# EAGLE design bigGenericPWM (EAGLE 4.16)
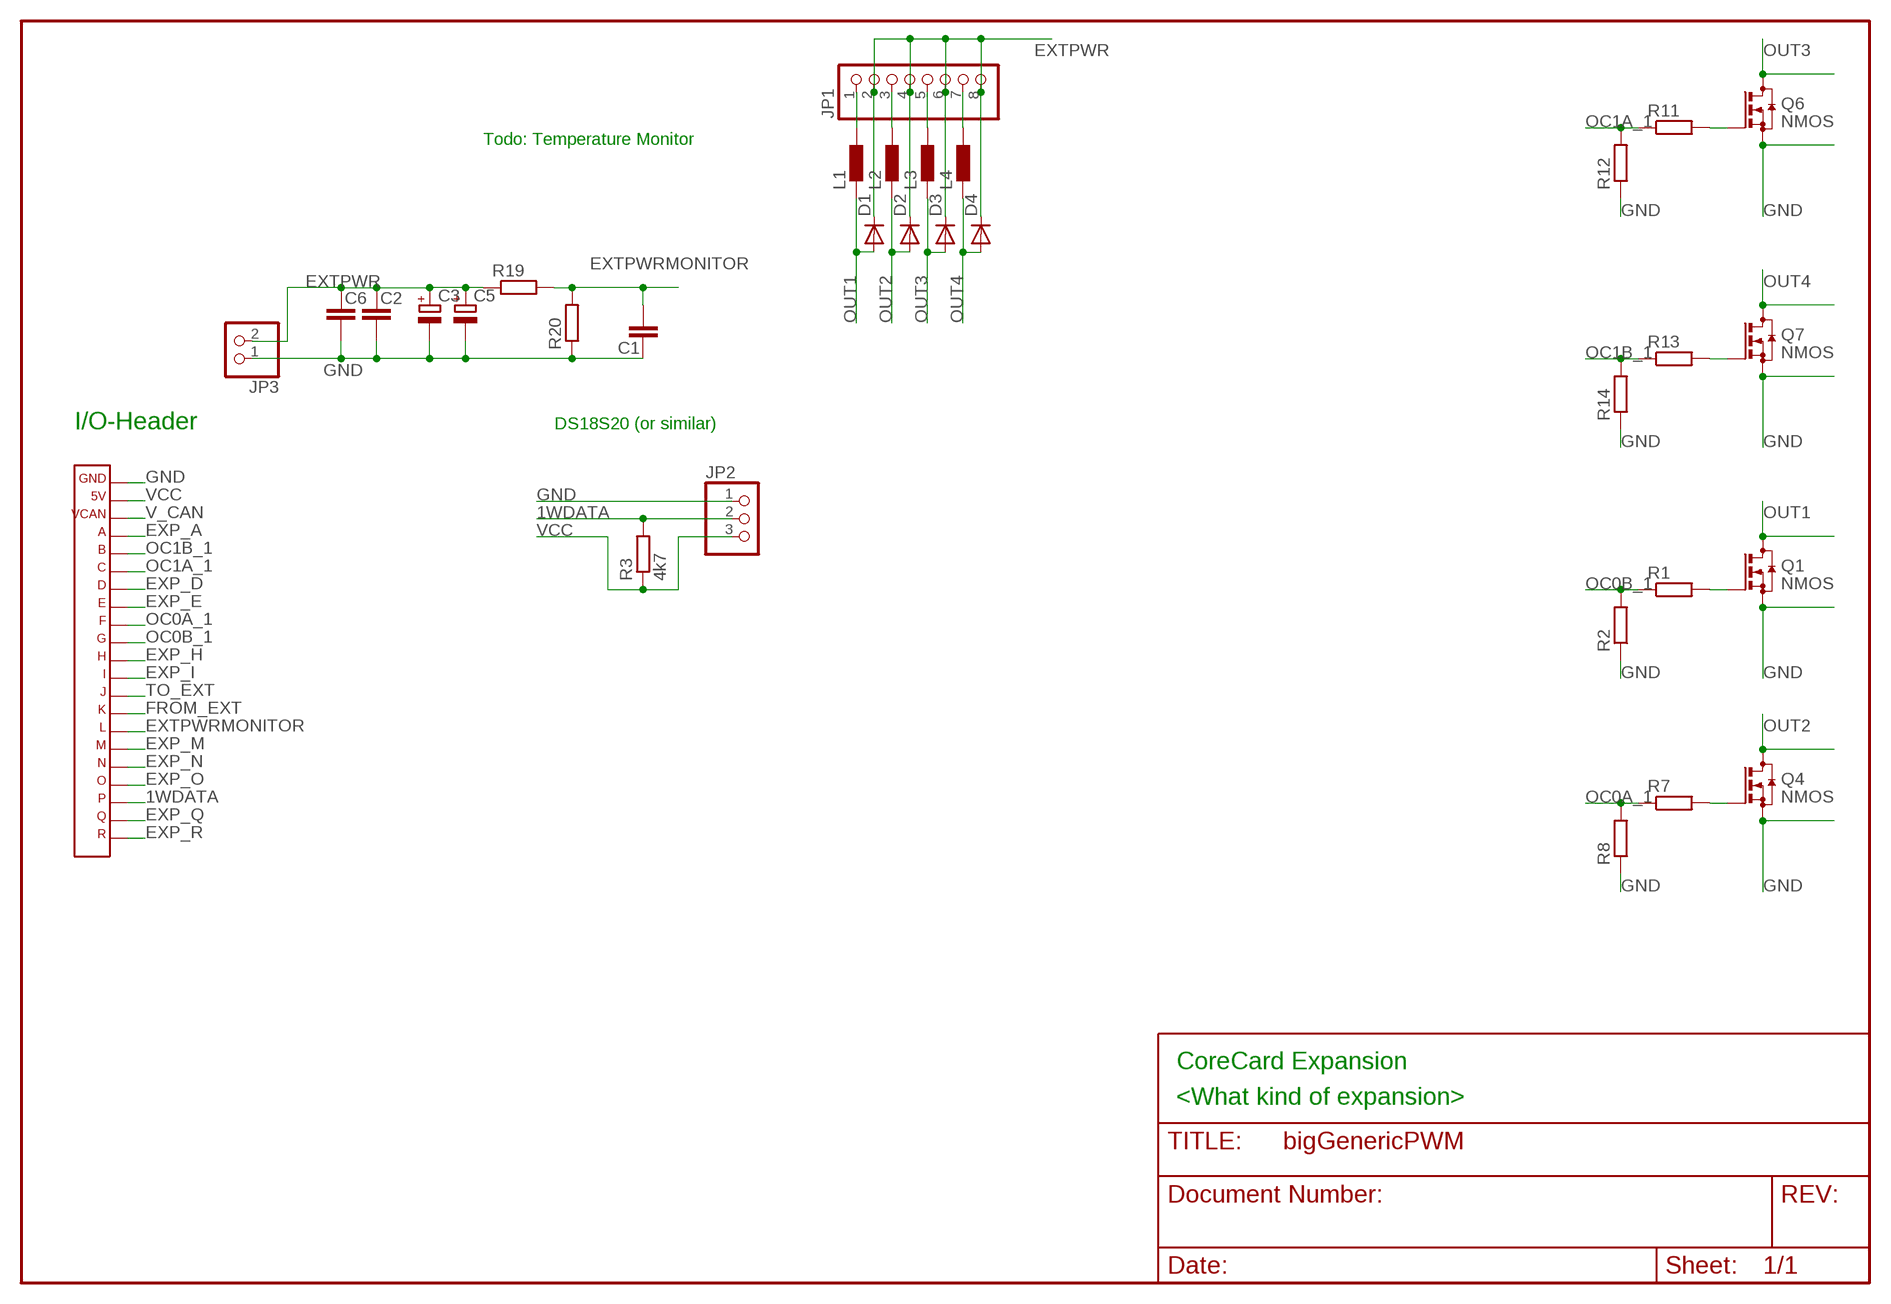
[diagram p0: schematic, sheet 1]

## Parts
C1  C-EUC0603  [C0603]
C2  C-EUC0603  [C0603]
C3  CPOL-EU  [153CLV-0807]
C5  CPOL-EU  [153CLV-0807]
C6  C-EUC0603  [C0603]
D1  DIODE-SMB  [SMB]
D2  DIODE-SMB  [SMB]
D3  DIODE-SMB  [SMB]
D4  DIODE-SMB  [SMB]
JP1  PINHD-2X04  [2X04]
JP2  PINHD-1X3  [1X03]
JP3  PINHD-1X2  [1X02]
L1  L-EUL0603  [L0603]
L2  L-EUL0603  [L0603]
L3  L-EUL0603  [L0603]
L4  L-EUL0603  [L0603]
Q1  NMOS  [SOT23]
Q4  NMOS  [SOT23]
Q6  NMOS  [SOT23]
Q7  NMOS  [SOT23]
R1  R-EUR0603  [R0603]
R2  R-EUR0603  [R0603]
R3  4k7  R-EUR0603  [R0603]
R7  R-EUR0603  [R0603]
R8  R-EUR0603  [R0603]
R11  R-EUR0603  [R0603]
R12  R-EUR0603  [R0603]
R13  R-EUR0603  [R0603]
R14  R-EUR0603  [R0603]
R19  R-EUR0603  [R0603]
R20  R-EUR0603  [R0603]
X3  CORE_IOHEADEXP  [CORE_IOHEAD_NOSILC]

## Nets
1WDATA: JP2.2 R3.2 X3.19
EXP_A: X3.4
EXP_D: X3.7
EXP_E: X3.8
EXP_H: X3.11
EXP_I: X3.12
EXP_M: X3.16
EXP_N: X3.17
EXP_O: X3.18
EXP_Q: X3.20
EXP_R: X3.21
EXTPWR: C2.1 C3.+ C5.+ C6.1 D1.C D2.C D3.C D4.C JP1.2 JP1.4 JP1.6 JP1.8 JP3.2 R19.1
EXTPWRMONITOR: C1.2 R19.2 R20.2 X3.15
FROM_EXT: X3.14
GND: C1.1 C2.2 C3.- C5.- C6.2 JP2.1 JP3.1 Q1.2(S) Q4.2(S) Q6.2(S) Q7.2(S) R2.1 R8.1 R12.1 R14.1 R20.1 X3.1
N$2: Q1.1(G) R1.2
N$3: JP1.3 L2.2
N$4: JP1.5 L3.2
N$6: Q4.1(G) R7.2
N$8: Q6.1(G) R11.2
N$9: Q7.1(G) R13.2
N$12: JP1.7 L4.2
N$18: JP1.1 L1.2
OC0A_1: R7.1 R8.2 X3.9
OC0B_1: R1.1 R2.2 X3.10
OC1A_1: R11.1 R12.2 X3.6
OC1B_1: R13.1 R14.2 X3.5
OUT1: D1.A L1.1 Q1.3(D)
OUT2: D2.A L2.1 Q4.3(D)
OUT3: D3.A L3.1 Q6.3(D)
OUT4: D4.A L4.1 Q7.3(D)
TO_EXT: X3.13
V_CAN: X3.3
VCC: JP2.3 R3.1 X3.2

## Notes on the sheet
- Todo: Temperature Monitor
- I/O-Header | DS18S20 (or similar)
- CoreCard Expansion
- <What kind of expansion>

## Library data of the parts
C1 C2 C6 = rcl:C-EU
C3 C5 = rcl:CPOL-EU
D1-D4 = diode:DIODE-: DIODE
JP1 = pinhead-mm:PINHD-2X04
JP2 = pinhead-mm:PINHD-1X3
JP3 = pinhead:PINHD-1X2: PIN HEADER
L1-L4 = rcl:L-EU
Q1 Q4 Q6 Q7 = transistor:NMOS
R1-R3 R7 R8 R11-R14 R19 R20 = rcl:R-EU
X3 = expboard:CORE_IOHEAD: CoreCard IO-header for expansion cards

## Board
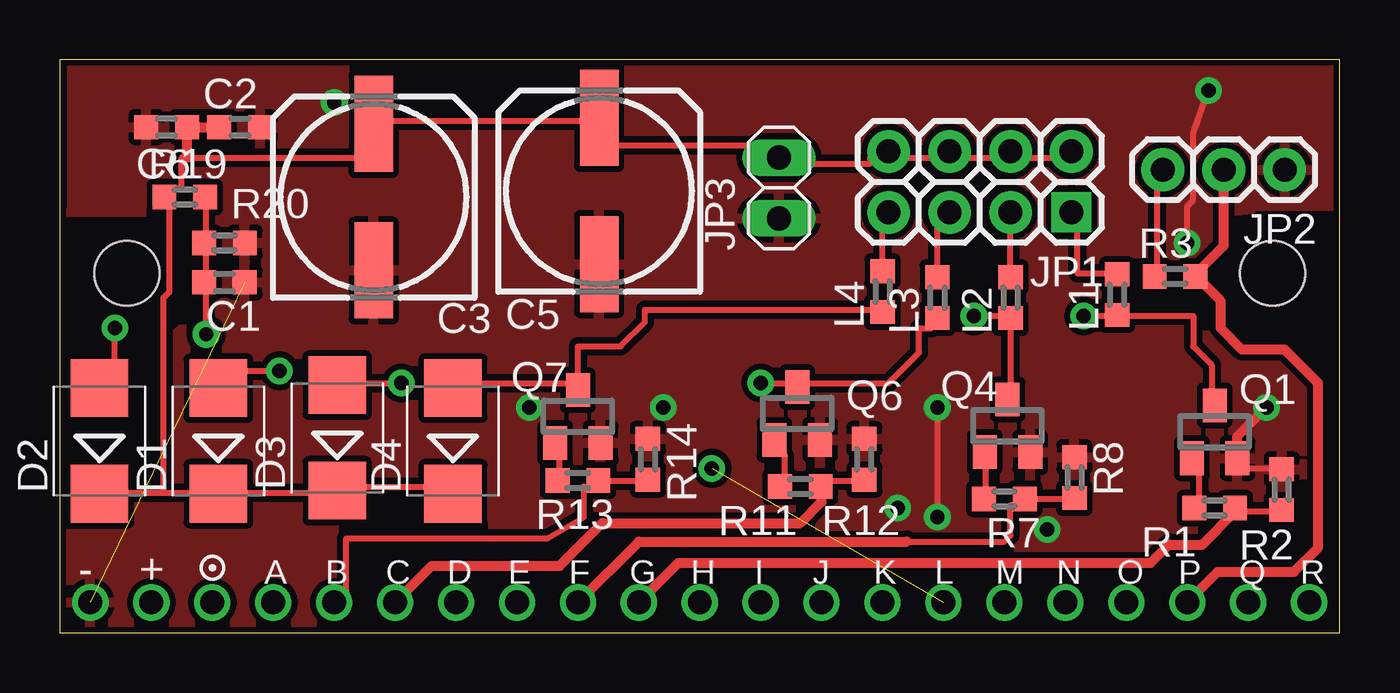
[diagram p1: board, top side]
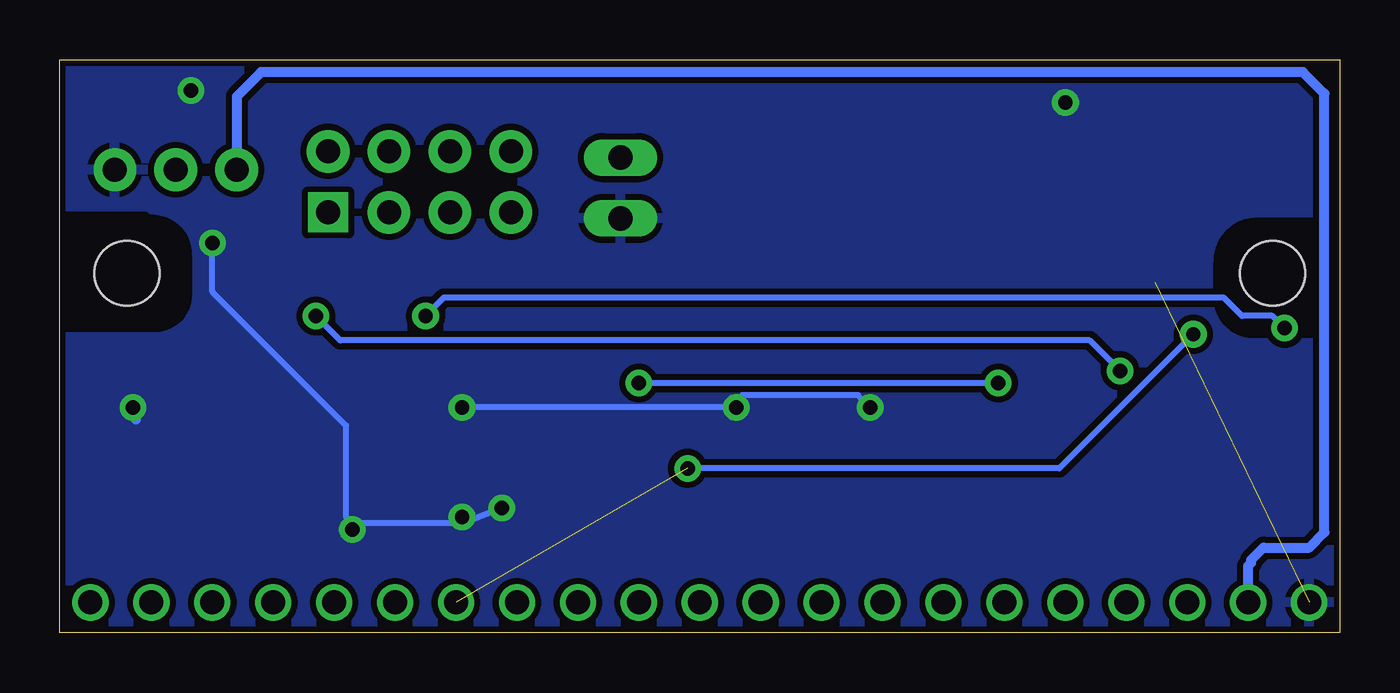
[diagram p2: board, bottom side, seen from below]

Size 53.34 x 23.88 mm. Coordinates in mm from the lower left corner, seen from the top.
Outline: 0,0 53.34,0 53.34,23.88 0,23.88 0,0
Copper layers (1*16): Top 0.035mm / dielectric 1.5mm / Bottom 0.035mm
Design rules "default": minimum track width 10mil, minimum drill 0.6mm, track to track 10mil, track to pad 10mil, pad to pad 10mil, via to via 10mil, smd to smd 8mil, copper to edge 10mil, drill to drill 8mil, minimum pad ring 10mil, minimum via ring 10mil, stop-mask expansion 4mil, vias tented up to drill 0mil, thermal gap 10mil
Holes 2.7 mm at 50.55,14.99 2.79,14.99

### Footprints (pad centres in the part's own frame; a part is rotated, then mirrored left to right if it is on the bottom)
C0603 = smd 1 x 1: 1 -0.85,0; 2 0.85,0
153CLV-0807 = smd 4 x 1.6: + 3.05,0; - -3.05,0
SMB = smd 2.4 x 2.4: A 2.2,0; C -2.2,0
2X04 = drill 1 pad 1.676 square: 1 -3.81,1.27 | drill 1 pad 1.778 round: 2 -3.81,-1.27; 3 -1.27,1.27; 4 -1.27,-1.27; 5 1.27,1.27; 6 1.27,-1.27; 7 3.81,1.27; 8 3.81,-1.27
1X03 = drill 1 pad 1.778 round: 1 -2.54,0; 2 0,0; 3 2.54,0
1X02 = drill 1.016 long: 1 -1.27,0; 2 1.27,0
L0603 = smd 0.991 x 1.016: 1 -0.85,0; 2 0.85,0
SOT23@1 = smd 1 x 1.4: 1 -0.95,-1.1; 2 0.95,-1.1; 3 0,1.1
R0603 = smd 0.991 x 1.016: 1 -0.85,0; 2 0.85,0
CORE_IOHEAD_NOSILC = drill 1 round: 1 25.4,0; 2 22.86,0; 3 20.32,0; 4 17.78,0; 5 15.24,0; 6 12.7,0; 7 10.16,0; 8 7.62,0; 9 5.08,0; 10 2.54,0; 11 0,0; 12 -2.54,0; 13 -5.08,0; 14 -7.62,0; 15 -10.16,0; 16 -12.7,0; 17 -15.24,0; 18 -17.78,0; 19 -20.32,0; 20 -22.86,0; 21 -25.4,0

### Placement (x,y rotation side)
C1  6.86,14.61 180 top
C2  7.49,21.08 0 top
C3  13.08,18.16 90 top
C5  22.48,18.41 90 top
C6  4.45,21.08 180 top
D1  6.6,8 90 top
D2  1.65,8 90 top
D3  11.56,8.13 90 top
D4  16.38,8 90 top
JP1  38.35,18.8 180 top
JP2  48.51,19.3 180 top
JP3  29.97,18.54 90 top
L1  44.07,14.1 90 top
L2  39.62,13.97 90 top
L3  36.58,13.97 90 top
L4  34.29,14.22 90 top
Q1  NMOS  [SOT23@1]  48.13,8.38 0 top
Q4  NMOS  [SOT23@1]  39.5,8.64 0 top
Q6  NMOS  [SOT23@1]  30.73,9.14 0 top
Q7  NMOS  [SOT23@1]  21.59,9.02 0 top
R1  48.13,5.21 180 top
R2  50.93,5.97 270 top
R3  46.48,14.86 0 top
R7  39.37,5.59 180 top
R8  42.29,6.48 270 top
R11  30.86,6.1 180 top
R12  33.53,7.24 270 top
R13  21.59,6.35 180 top
R14  24.51,7.24 270 top
R19  5.21,18.16 0 top
R20  6.86,16.26 180 top
X3  26.67,1.27 0 bottom

### Tracks (layer width: path | path; a pad name or v marks a point on that pad's centre or on a via)
1WDATA
  Top 0.406: X3.19 48.26,2.54 51.44,2.54 52.45,3.56 52.45,10.41 51.05,11.81 49.28,11.81 48.39,12.7 48.39,13.84 47.37,14.86 R3.2 47.33,14.95 48.51,16.13 JP2.2
EXTPWR
  Top 0.254: 4.32,5.84 5.59,5.84 D1.C 7.62,5.84 10.41,5.84 D3.C 12.7,6.1 15.24,6.1 D4.C | 4.32,5.84 2.79,5.84 D2.C | R19.1 4.06,18.03 | R19.1 4.83,18.54 5.08,18.54 5.08,19.81 5.33,19.81 12.45,19.81 C3.+ 13.72,21.34 21.84,21.34 C5.+ 23.11,20.32 28.7,20.32 JP3.2 31.24,19.56 33.78,19.56 33.78,19.81 JP1.8 35.31,19.81 36.32,19.81 JP1.6 37.85,19.81 38.86,19.81 JP1.4 40.39,19.81 41.4,19.81 JP1.2 | 4.32,5.84 4.32,13.97 4.57,14.22 4.57,17.78 R19.1
  Top 0.406: C2.1 C6.1 5.29,19.85 5.33,19.81
EXTPWRMONITOR  (via drill 0.6)  (1 unrouted)
  Top 0.254: R19.2 6.1,17.78 6.1,16.51 R20.2 6.1,16 6.1,14.99 C1.2 6.1,14.22 v6.1,12.45
  Bottom 0.254: v6.1,12.45 11.68,6.86 v27.18,6.86
GND  (via drill 0.6)  (1 unrouted)
  Top 0.254: v36.58,9.4 v36.58,4.83 | v46.99,16.26 46.99,17.78 47.24,18.03 47.24,20.83 v47.88,22.61 | Q1.2 49.53,6.86 50.55,6.86 R2.1
  Top 0.406: Q1.2 49.08,8.19 v50.29,9.4
  Bottom 0.254: 36.58,4.57 v34.92,5.21 | 36.58,4.57 41.15,4.57 v41.15,4.32 41.4,4.83 41.4,8.64 46.99,14.22 v46.99,16.26 | v36.58,4.83 36.58,4.57 | v36.58,9.4 v25.15,9.4 24.89,9.91 20.07,9.91 v19.56,9.4
  Bottom 0.406: v50.29,9.4 50.29,9.02 50.16,8.89
  other vias: 11.43,22.1
  pour Top: 0.51,31.37 53.21,31.37 53.21,17.78 49.66,17.78 49.66,17.65 arc90 47.75,15.75 47.75,14.1 arc90 49.53,12.32 53.85,12.32 53.85,-0.13 0.38,-0.13 0.38,12.06 3.68,12.06 arc90 5.59,13.97 5.59,15.49 arc90 3.56,17.53 0.38,17.53 0.51,17.53
  pour Bottom: 0.38,31.5 53.09,31.5 53.09,17.78 49.53,17.78 49.53,17.65 arc90 47.62,15.75 47.62,14.1 arc90 49.4,12.32 53.72,12.32 53.72,-0.13 0.38,-0.13 0.25,12.06 3.56,12.06 arc90 5.46,13.97 5.46,15.49 arc90 3.43,17.53 0.25,17.53 0.38,17.53
N$2
  Top 0.254: R1.2 47.5,5.59 47.5,6.6 Q1.1
N$3
  Top 0.254: L2.2 JP1.3
N$4
  Top 0.254: L3.2 36.58,17.02 JP1.5
N$6
  Top 0.254: R7.2 38.61,5.84 38.61,6.86 Q4.1
N$8
  Top 0.254: R11.2 30.23,6.35 30.23,7.37 Q6.1
N$9
  Top 0.254: R13.2 20.83,6.6 20.83,7.37 Q7.1
N$12
  Top 0.254: L4.2 34.29,16.76 JP1.7
N$18
  Top 0.254: L1.2 43.69,14.99 42.42,14.99 42.42,16.76 JP1.1
OC0A_1
  Top 0.254: R8.2 41.91,5.59 R7.1 39.88,5.33 39.62,5.33 39.62,4.06 39.37,3.81 35.31,3.81
  Top 0.406: X3.9 24.13,3.81 35.31,3.81
OC0B_1
  Top 0.254: R1.1 49.28,5.08 50.55,5.08 R2.2
  Top 0.406: X3.10 25.78,2.92 45.47,2.92 46.23,3.68 47.62,3.68 48.98,5.04 R1.1 48.98,5.17 48.9,5.08
OC1A_1
  Top 0.254: R11.1 32,6.35 33.27,6.35 R12.2
  Top 0.406: X3.6 15.49,2.79 20.83,2.79 22.61,4.57 30.86,4.57 31.75,5.46 31.75,6.06 R11.1
OC1B_1
  Top 0.254: R14.2 24.13,6.35 R13.1 22.1,6.1 21.84,6.1 21.84,4.83 20.32,3.94 11.94,3.94 11.94,1.78 X3.5
OUT1  (via drill 0.6)
  Top 0.254: Q1.3 48.01,10.16 48.01,11.18 47.24,11.94 47.24,13.21 44.45,13.21 L1.1 43.69,13.21 v42.67,13.21 | v9.14,10.92 7.62,10.92 D1.A
  Bottom 0.254: v9.14,10.92 10.41,12.19 41.66,12.19 v42.67,13.21
OUT2  (via drill 0.6)
  Top 0.254: Q4.3 39.62,10.41 L2.1 39.37,13.21 v38.1,13.21 | v2.29,12.7 2.29,11.18 D2.A
  Bottom 0.254: v2.29,12.7 2.79,13.21 4.06,13.21 4.83,13.97 37.34,13.97 v38.1,13.21
OUT3  (via drill 0.6)
  Top 0.254: L3.1 36.32,12.7 35.81,12.7 35.81,11.68 34.54,10.41 30.99,10.41 Q6.3 30.48,10.41 v29.21,10.41 | v14.22,10.41 12.7,10.41 D3.A
  Bottom 0.254: v14.22,10.41 v29.21,10.41
OUT4
  Top 0.254: L4.1 34.04,13.46 24.38,13.46 24.38,12.95 23.37,11.94 21.59,11.94 Q7.3 21.34,10.41 17.53,10.41 D4.A
VCC
  Top 0.254: R3.1 45.72,15.24 45.72,18.54 JP2.3
  Bottom 0.406: X3.2 3.81,2.79 3.68,2.92 3.68,3.05 3.17,3.56 1.27,3.56 0.64,4.19 0.64,22.48 1.52,23.37 44.96,23.37 45.97,22.35 45.97,19.56 45.85,19.43 JP2.3

### Text on the board
tPlace: - | + | A | B | C | D | E | F | G | H | I | J | K | L | M | N | O | P | Q | R
Document: Top is component side | Expansion will be mounted bottom to bottom with CoreCard | Change vertical dimension to fit | Remove I/O-header silcscreen if neccesary | Remove mounting holes if neccesary